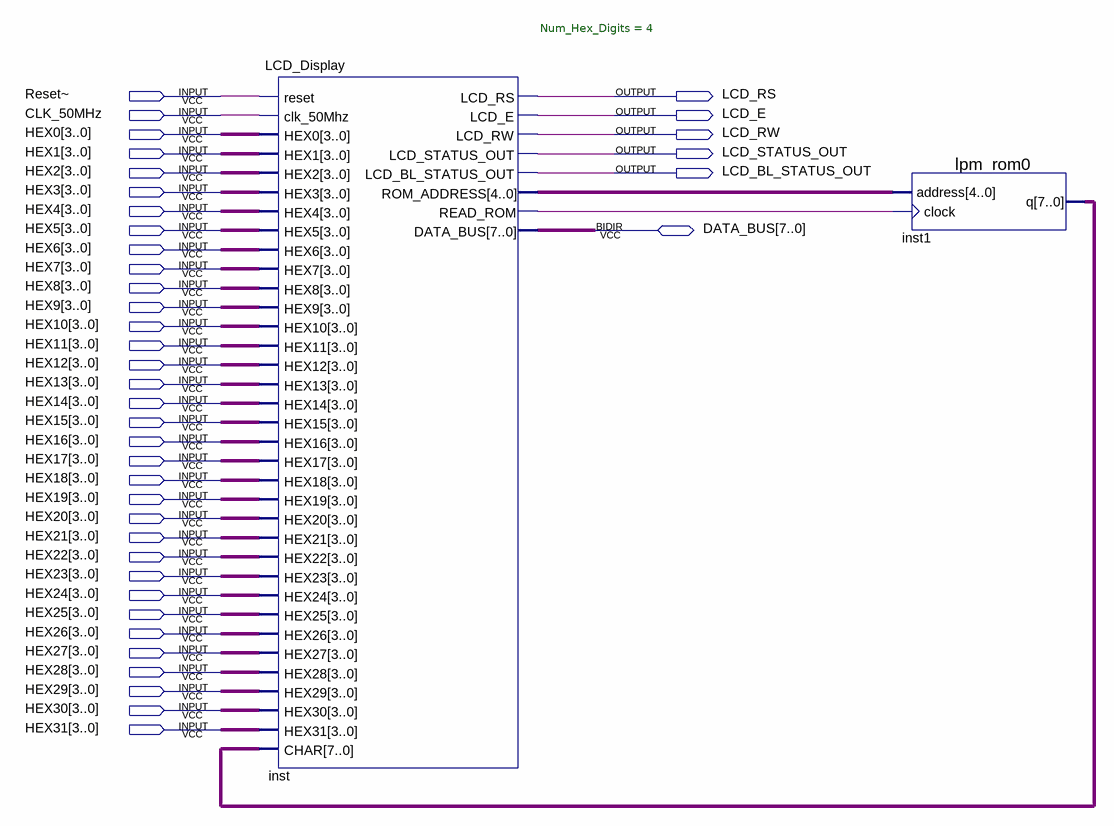
[diagram p0: schematic sheet]
// Quartus schematic NewLCD.bdf as structural Verilog: 2 symbols, 40 pins
module NewLCD (
  input  \Reset~ ,
  input  CLK_50MHz,
  input  [3:0] HEX0,
  input  [3:0] HEX1,
  input  [3:0] HEX2,
  input  [3:0] HEX3,
  input  [3:0] HEX4,
  input  [3:0] HEX5,
  input  [3:0] HEX6,
  input  [3:0] HEX7,
  input  [3:0] HEX8,
  input  [3:0] HEX9,
  input  [3:0] HEX10,
  input  [3:0] HEX11,
  input  [3:0] HEX12,
  input  [3:0] HEX13,
  input  [3:0] HEX14,
  input  [3:0] HEX15,
  input  [3:0] HEX16,
  input  [3:0] HEX17,
  input  [3:0] HEX18,
  input  [3:0] HEX19,
  input  [3:0] HEX20,
  input  [3:0] HEX21,
  input  [3:0] HEX22,
  input  [3:0] HEX23,
  input  [3:0] HEX24,
  input  [3:0] HEX25,
  input  [3:0] HEX26,
  input  [3:0] HEX27,
  input  [3:0] HEX28,
  input  [3:0] HEX29,
  input  [3:0] HEX30,
  input  [3:0] HEX31,
  inout  [7:0] DATA_BUS,
  output LCD_RS,
  output LCD_E,
  output LCD_RW,
  output LCD_STATUS_OUT,
  output LCD_BL_STATUS_OUT
);

  wire inst_read_rom;
  wire [4:0] inst_rom_address;
  wire [7:0] inst1_q;

  LCD_Display #(.Num_Hex_Digits(4)) inst (
    .reset(\Reset~ ), .clk_50Mhz(CLK_50MHz), .HEX0(HEX0), .HEX1(HEX1), .HEX2(HEX2), .HEX3(HEX3), .HEX4(HEX4),
    .HEX5(HEX5), .HEX6(HEX6), .HEX7(HEX7), .HEX8(HEX8), .HEX9(HEX9), .HEX10(HEX10), .HEX11(HEX11),
    .HEX12(HEX12), .HEX13(HEX13), .HEX14(HEX14), .HEX15(HEX15), .HEX16(HEX16), .HEX17(HEX17), .HEX18(HEX18),
    .HEX19(HEX19), .HEX20(HEX20), .HEX21(HEX21), .HEX22(HEX22), .HEX23(HEX23), .HEX24(HEX24), .HEX25(HEX25),
    .HEX26(HEX26), .HEX27(HEX27), .HEX28(HEX28), .HEX29(HEX29), .HEX30(HEX30), .HEX31(HEX31), .CHAR(inst1_q),
    .LCD_RS(LCD_RS), .LCD_E(LCD_E), .LCD_RW(LCD_RW), .LCD_STATUS_OUT(LCD_STATUS_OUT),
    .LCD_BL_STATUS_OUT(LCD_BL_STATUS_OUT), .ROM_ADDRESS(inst_rom_address), .READ_ROM(inst_read_rom),
    .DATA_BUS(DATA_BUS));
  lpm_rom0 inst1 (.address(inst_rom_address), .clock(inst_read_rom), .q(inst1_q));
endmodule
